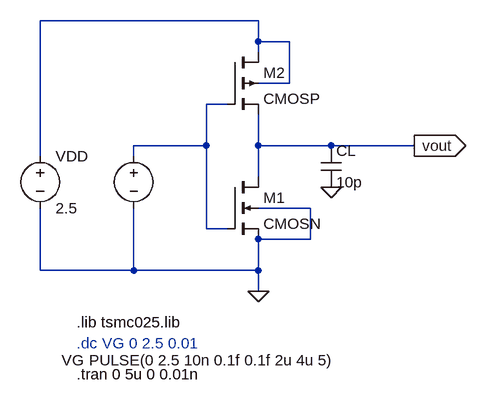
[diagram p0: schematic 45n_inv_dyn_char.asc]
45n_inv_dyn_char.asc, the LTspice schematic file:
Version 4
SHEET 1 880 680
WIRE 224 64 -112 64
WIRE 224 96 224 64
WIRE 272 96 224 96
WIRE 224 112 224 96
WIRE 272 160 272 96
WIRE 272 160 224 160
WIRE 176 192 144 192
WIRE 144 256 144 192
WIRE 144 256 32 256
WIRE 224 256 224 208
WIRE 336 256 224 256
WIRE 464 256 336 256
WIRE -112 272 -112 64
WIRE 32 272 32 256
WIRE 224 304 224 256
WIRE 304 352 224 352
WIRE 144 384 144 256
WIRE 176 384 144 384
WIRE 304 400 304 352
WIRE 304 400 224 400
WIRE -112 448 -112 352
WIRE 32 448 32 352
WIRE 32 448 -112 448
WIRE 224 448 224 400
WIRE 224 448 32 448
WIRE 224 480 224 448
FLAG 224 480 0
FLAG 464 256 vout
IOPIN 464 256 Out
FLAG 336 320 0
SYMBOL voltage -112 256 R0
SYMATTR InstName VDD
SYMATTR Value 2.5
SYMBOL voltage 32 256 R0
WINDOW 0 -111 330 Left 2
WINDOW 3 -69 330 Left 2
WINDOW 123 0 0 Left 0
WINDOW 39 0 0 Left 0
SYMATTR InstName VG
SYMATTR Value PULSE(0 2.5 10n 0.1f 0.1f 2u 4u 5)
SYMBOL cmosn 176 304 R0
SYMATTR InstName M1
SYMATTR Value2 l=240n w=360n ad=0.1728p as=0.1728p pd=1680n ps=1680n
SYMBOL cmosp 176 112 R0
SYMATTR InstName M2
SYMATTR Value2 l=240n w=360n ad=0.1728p as=0.1728p pd=1680n ps=1680n
SYMBOL cap 320 256 R0
SYMATTR InstName CL
SYMATTR Value 10p
TEXT -56 528 Left 2 !.lib tsmc025.lib
TEXT -56 560 Left 2 ;.dc VG 0 2.5 0.01
TEXT -56 608 Left 2 !.tran 0 5u 0 0.01n

The netlist it stands for:
* 45n_inv_dyn_char.asc
VDD N001 0 2.5
VG N002 0 PULSE(0 2.5 10n 0.1f 0.1f 2u 4u 5)
M1 vout N002 0 0 CMOSN l=240n w=360n ad=0.1728p as=0.1728p pd=1680n ps=1680n
M2 N001 N002 vout N001 CMOSP l=240n w=360n ad=0.1728p as=0.1728p pd=1680n ps=1680n
CL vout 0 10p
.model NMOS NMOS
.model PMOS PMOS
.lib standard.mos
.lib tsmc025.lib
* .dc VG 0 2.5 0.01
.tran 0 5u 0 0.01n
.backanno
.end